# Altium schematic sheet 11 USB_KEY_GSENSOR.SchDoc
size 420 x 297 mm; Organization: Altium Limited; Address1: L3, 12a Rodborough Rd; Address2: Frenchs Forest; Address3: NSW; Address4: Australia 2086
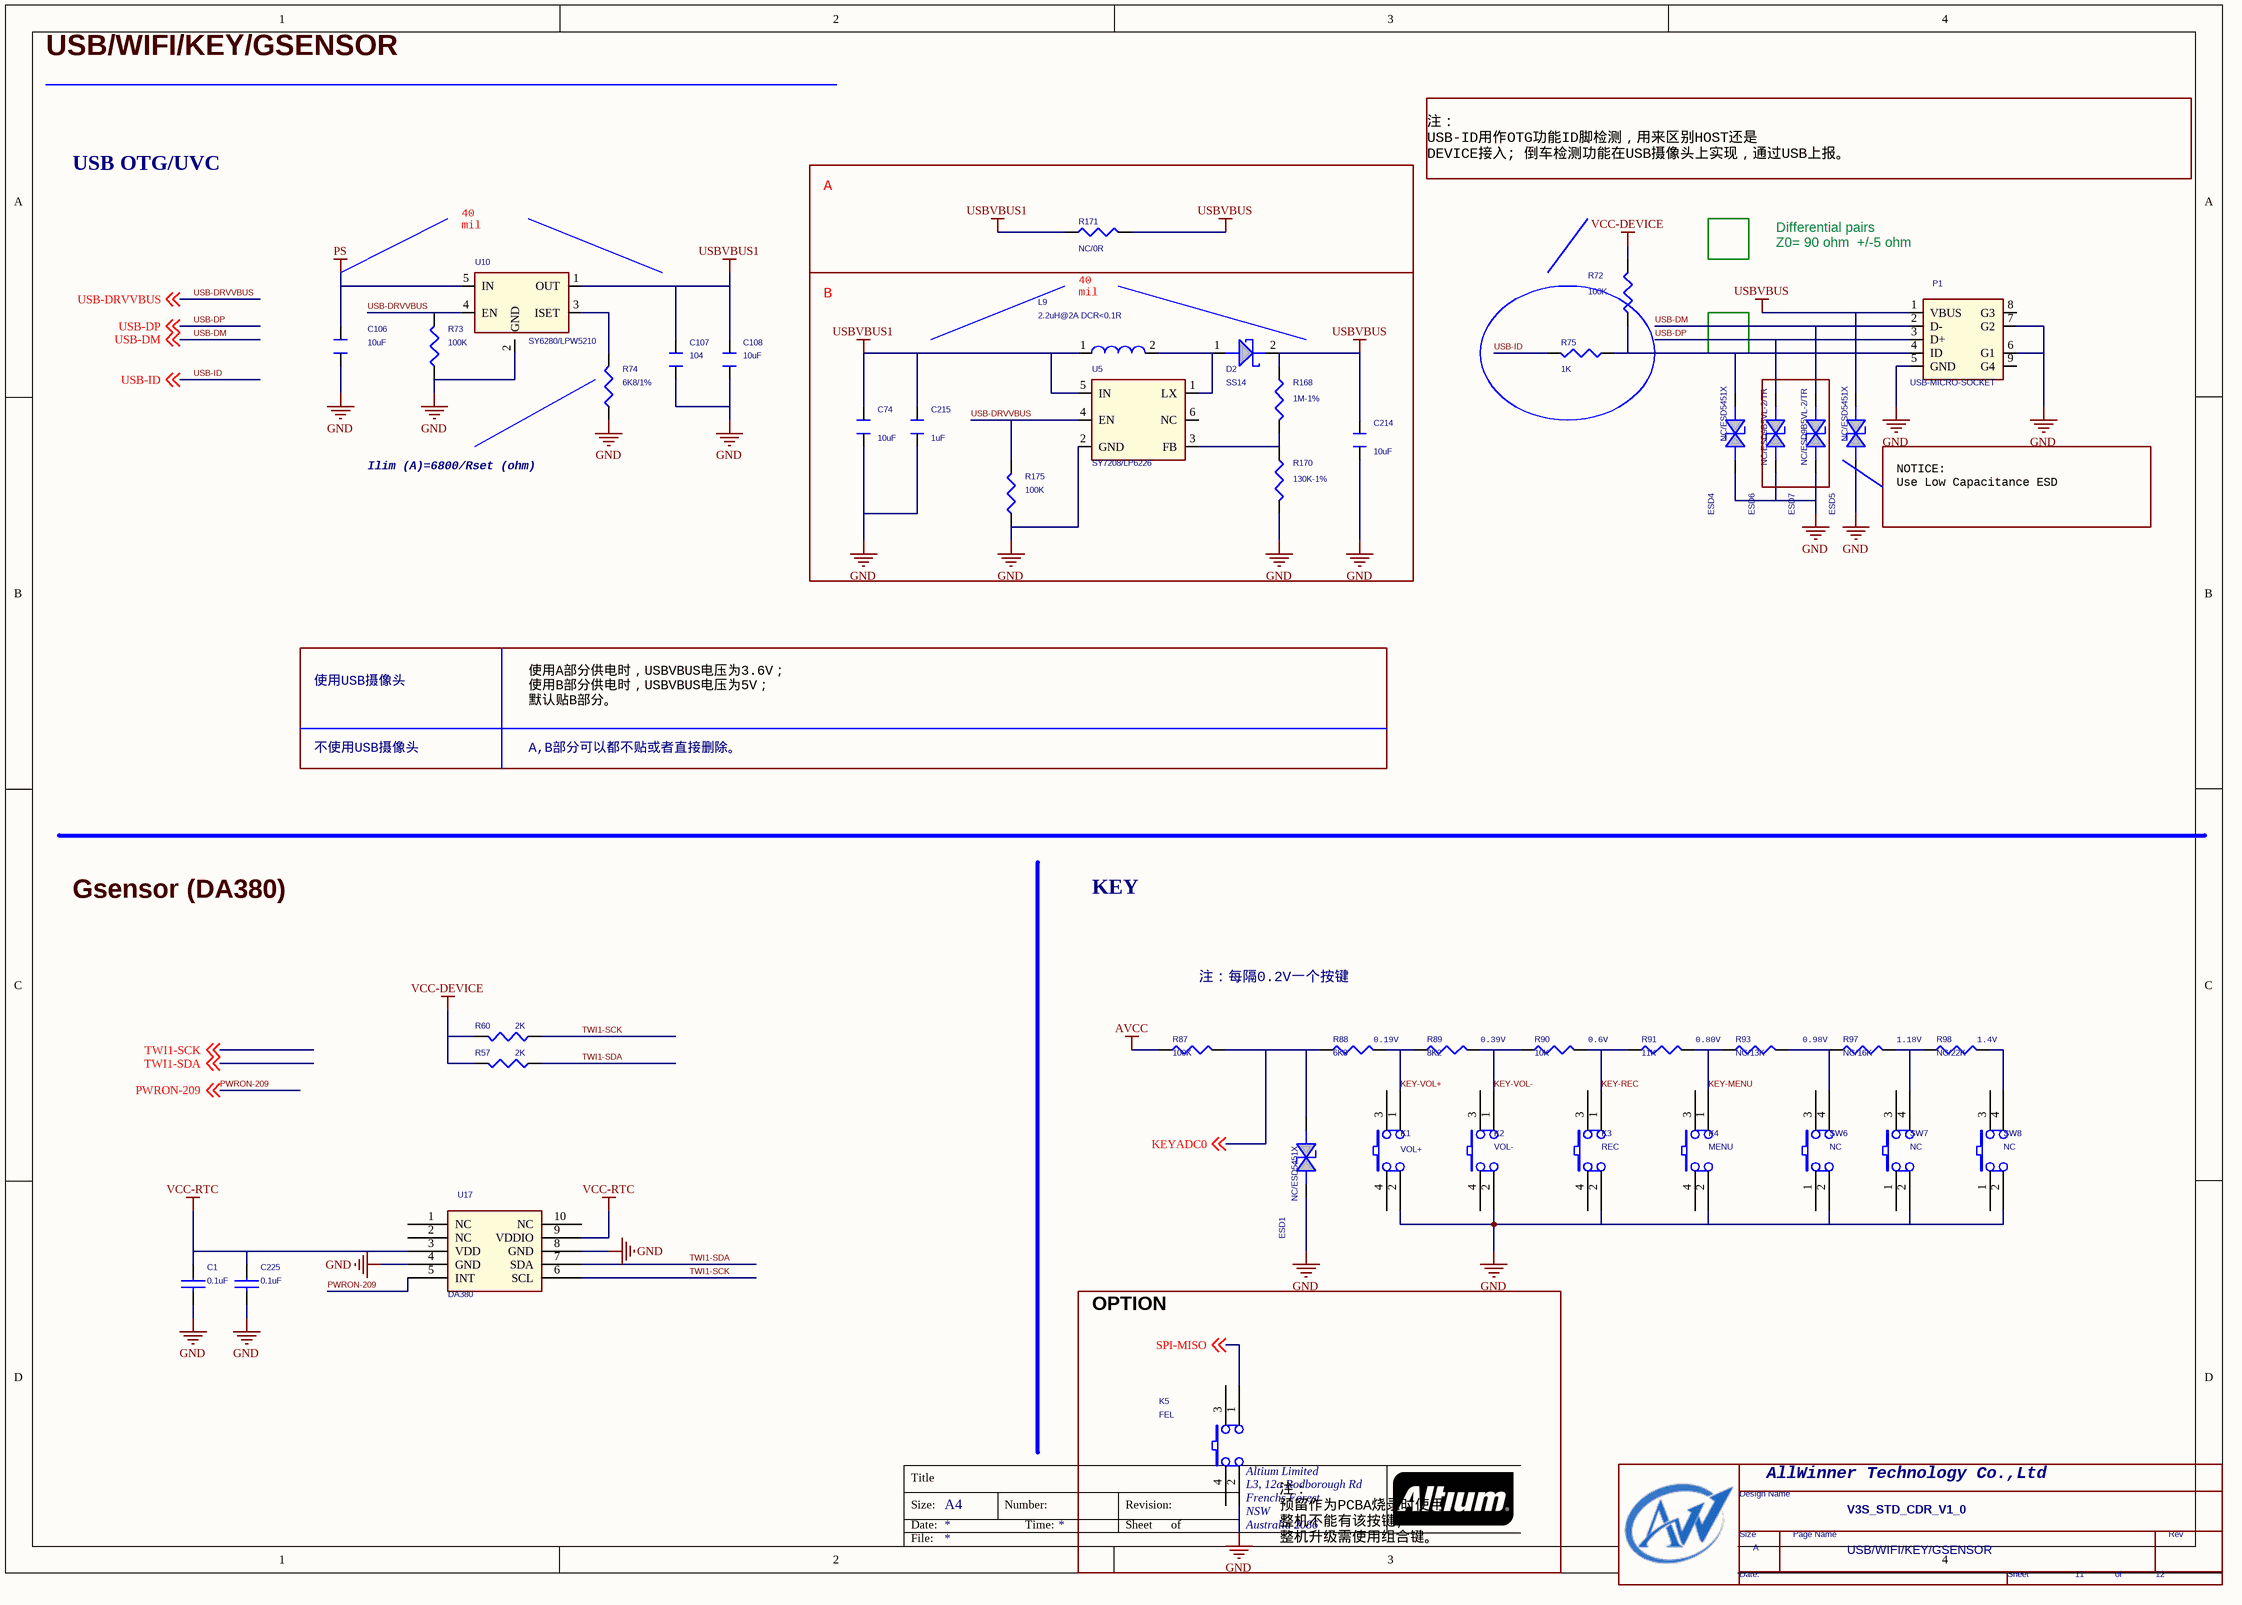
[diagram p0: 11 USB_KEY_GSENSOR.SchDoc]

## Parts
*  Page Count: 12  Page Number: 11  Page Size: A  Title: V3S_STD_CDR_V1_0  Doc: USB/WIFI/KEY/GSENSOR  (hidden comment: TitleBlock0-AW)  (graphical)
C1  0.1uF  [C0402]
C74  10uF  [C0603]
C106  10uF  [C0603]
C107  104  [C0402]
C108  10uF  [C0603]
C214  10uF  [C0603]
C215  1uF  [C0402]
C225  0.1uF  [C0402]
D2  SS14  [SOD123]
ESD1  NC/ESD5451X  [ESD0402]
ESD4  NC/ESD5451X  [ESD0402]
ESD5  NC/ESD5451X  [ESD0402]
ESD6  NC/ESD9B5VL-2/TR  [ESD0402]
ESD7  NC/ESD9B5VL-2/TR  [ESD0402]
K1  VOL+  [SW4]
K2  VOL-  [SW4]
K3  REC  [SW4]
K4  MENU  [SW4]
K5  FEL  [SW4]
L9  2.2uH@2A DCR<0.1R  [CD32]
P1  USB-MICRO-SOCKET  [USB_MINI_AB]
R57  2K  [R0402]
R60  2K  [R0402]
R72  100K  [R0402]
R73  100K  [R0402]
R74  6K8/1%  [R0402]
R75  1K  [R0402]
R87  100K  [0805]
R88  6K8  [0805]
R89  8K2  [0805]
R90  10K  [0805]
R91  11K  [0805]
R93  NC/13K  [0805]
R97  NC/16K  [0805]
R98  NC/22K  [0805]
R168  1M-1%  [R0402]
R170  130K-1%  [R0402]
R171  NC/0R  [R0603]
R175  100K  [R0402]
SW6  NC  [SW4]
SW7  NC  [SW4]
SW8  NC  [SW4]
U5  SY7208/LP6226  [SOT23-6]
U10  SY6280/LPW5210  [SOT23-6]
U17  DA380  [DA380]

## Blocks framed on the sheet
A: R171
B: C74 C214 C215 D2 L9 R168 R170 R175 U5

## Nets
AVCC: R87.1
GND: C1.2 C74.1 C106.1 C107.1 C108.1 C214.1 C215.1 C225.2 ESD1.2(CATHODE) ESD4.2(CATHODE) ESD5.2(CATHODE) ESD6.2(CATHODE) ESD7.2(CATHODE) K1.2 K2.2 K3.2 K4.2 K5.2 P1.5(GND) P1.6(G1) P1.7(G2) R73.1 R74.1 R170.2 R175.1 SW6.2 SW7.2 SW8.2 U5.2(GND) U10.2(GND) U17.4(GND) U17.8(GND)
PS: C106.2 U10.5(IN)
USBVBUS: C214.2 D2.2 ESD5.1(ANODE) P1.1(VBUS) R168.1 R171.2
USBVBUS1: C74.2 C107.2 C108.2 C215.2 L9.1 R171.1 U5.5(IN) U10.1(OUT)
VCC-DEVICE: R57.2 R60.2 R72.2
VCC-RTC: C1.1 C225.1 U17.3(VDD) U17.9(VDDIO)
KEY-MENU: K4.1 R91.2 R93.1
KEY-REC: K3.1 R90.2 R91.1
KEY-VOL+: K1.1 R88.2 R89.1
KEY-VOL-: K2.1 R89.2 R90.1
KEYADC0: ESD1.1(ANODE) R87.2 R88.1 ; off-sheet KEYADC0
PWRON-209: U17.5(INT) ; off-sheet PWRON-209
SPI-MISO: K5.1 ; off-sheet SPI-MISO
TWI1-SCK: R60.1 U17.6(SCL) ; off-sheet TWI1-SCK
TWI1-SDA: R57.1 U17.7(SDA) ; off-sheet TWI1-SDA
USB-DM: ESD7.1(ANODE) P1.2(D-) ; off-sheet USB-DM
USB-DP: ESD6.1(ANODE) P1.3(D+) ; off-sheet USB-DP
USB-DRVVBUS: R73.2 R175.2 U5.4(EN) U10.4(EN) ; off-sheet USB-DRVVBUS
USB-ID: R75.2 ; off-sheet USB-ID
NetD2_1: D2.1 L9.2 U5.1(LX)
NetESD4_1: ESD4.1(ANODE) P1.4(ID) R72.1 R75.1
NetR74_2: R74.2 U10.3(ISET)
NetR93_2: R93.2 R97.1 SW6.4
NetR97_2: R97.2 R98.1 SW7.4
NetR98_2: R98.2 SW8.4
NetR168_2: R168.2 R170.1 U5.3(FB)

Not connected (* = marked no-connect by the designer): K1 3 4; K2 3 4; K3 3 4; K4 3 4; K5 3 4; P1 8(G3) 9(G4); SW6 1 3; SW7 1 3; SW8 1 3; U5 6(NC); U17 1(NC) 2(NC) 10(NC)

## Notes on the sheet
- USB/WIFI/KEY/GSENSOR
- 注：
  USB-ID用作OTG功能ID脚检测，用来区别HOST还是
  DEVICE接入; 倒车检测功能在USB摄像头上实现，通过USB上报。
- USB OTG/UVC
- (near U10) 40
  mil
- Differential pairs
  Z0= 90 ohm  +/-5 ohm
- 40
  mil
- (near ESD5) NOTICE:
  Use Low Capacitance ESD
- Ilim (A)=6800/Rset (ohm)
- 使用A部分供电时，USBVBUS电压为3.6V；
  使用B部分供电时，USBVBUS电压为5V；
  默认贴B部分。
- 使用USB摄像头
- 不使用USB摄像头
- A,B部分可以都不贴或者直接删除。
- Gsensor (DA380)
- KEY
- 注：每隔0.2V一个按键
- (near R88) 0.19V
- (near R89) 0.39V
- (near R90) 0.6V
- 0.80V
- 0.98V
- 1.18V
- (near R98) 1.4V
- OPTION
- (near *) 注：
  预留作为PCBA烧录时使用，
  整机不能有该按键;
  整机升级需使用组合键。
- Title
- Size:
- Date:
- A4
- Number:
- Time:
- Revision:
- Sheet
- of
- File:
- (in symbol TitleBlock0-AW) AllWinner Technology Co.,Ltd; Design Name; Size; Page Name; Rev; Date:; Sheet; of

## Library data of the parts
* = TitleBlock0-AW: RevCode: 0.1; Page Create Date: March  8, 1995
C1 C225 = CAP NP: MC 0.1uF 6.3V X5R K 0201; Schematic Part: \\172.16.1.197\db\discrete\cap; Part Number: VG0327671041801; Tolerance: K; Voltage: 6.3V
C74 C214 C215 = CAPACITOR_0_Dup1: PAGE: 1
C106 = CAPACITOR_Dup1
C107 C108 = CAPACITOR_Dup1: Page: 9
D2 = DIODE_SCHOTTKY_0
ESD1 ESD4-ESD7 = 1_1.5KE100A: 1ST PART DESCRIPTION: WILL ESD9B5V Bidirection ESD Protection; Page: 11
K1 = SW_PUSH_2: SDTSourceLibName: C:\WIND95\TEMP\6200.LIB; Page: 11
K2 = SW_PUSH_3: SDTSourceLibName: C:\WIND95\TEMP\6200.LIB; Page: 11
K3 = SW_PUSH_4: SDTSourceLibName: C:\WIND95\TEMP\6200.LIB; Page: 11
K4 K5 = SW_PUSH_5: SDTSourceLibName: C:\WIND95\TEMP\6200.LIB; Page: 11
L9 = INDUCTOR_Dup1
P1 = USB_MINI_SOCKET_2
R57 R60 R168 R170 R171 = R_Dup4
R72 R75 = R_Dup3
R73 R74 R175 = R_Dup3: Page: 9
R87-R91 = R1 0805_Dup2: Page: 11
R93 R97 R98 = R1 0805
SW6-SW8 = SW_PUSH: SDTSourceLibName: C:\WIND95\TEMP\6200.LIB
U5 = RT9266PE_3
U10 = RT9266PE_2: Page: 9
U17 = GPR25L005B_0